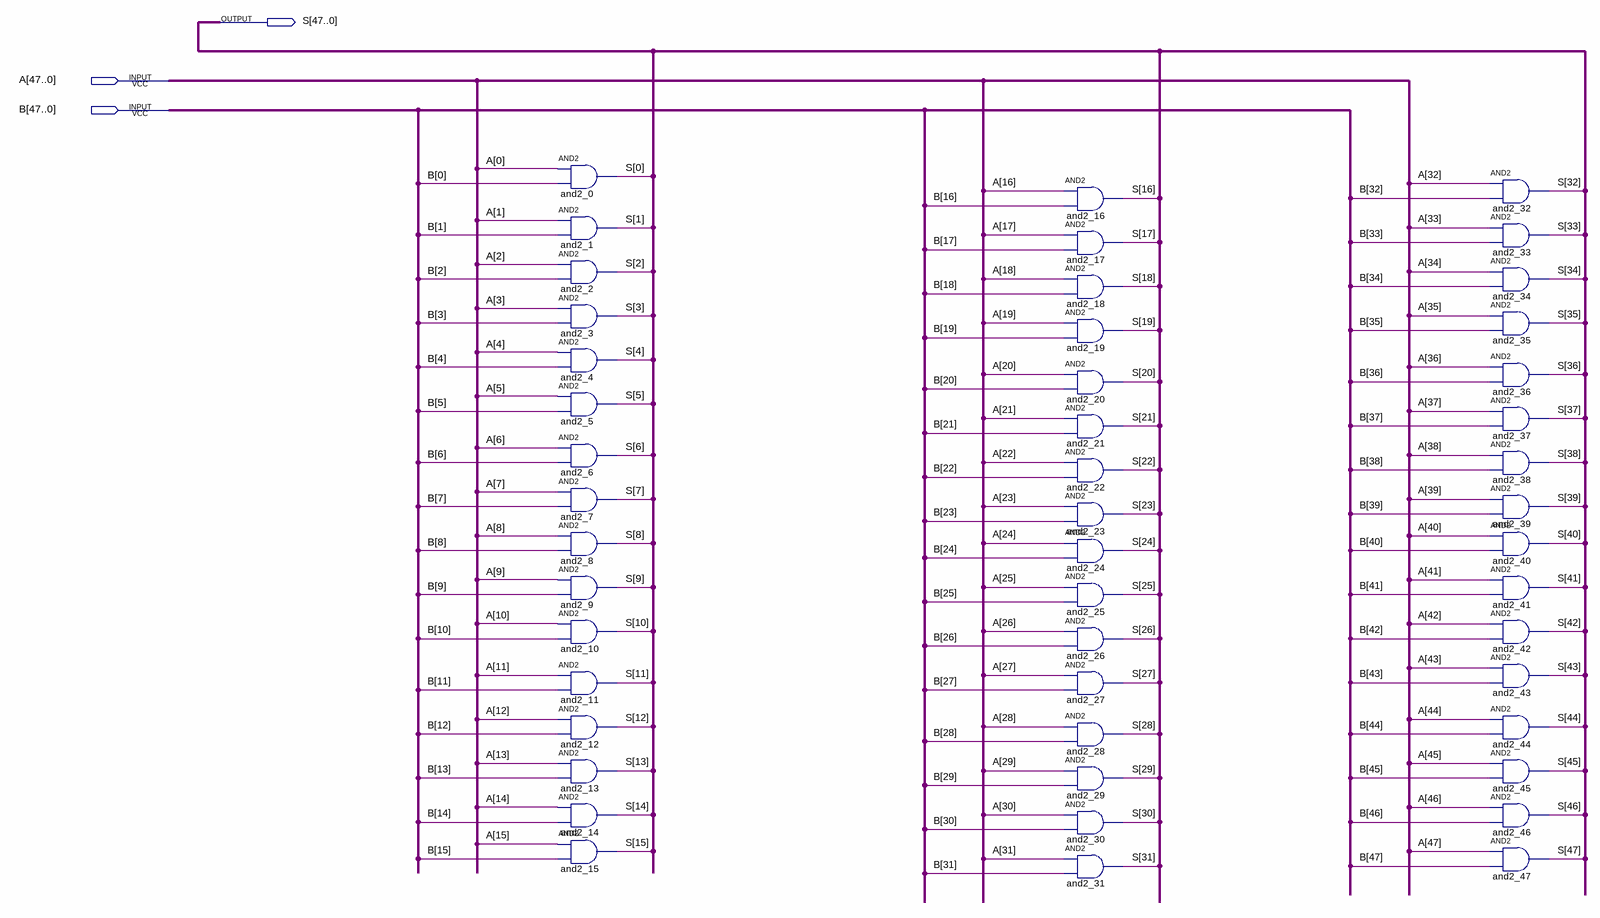
[diagram p0: schematic sheet]
// Quartus schematic AND_48bit.bdf as structural Verilog: 48 symbols, 3 pins
module AND_48bit (
  input  [47:0] A,
  input  [47:0] B,
  output [47:0] S
);

  and and2_0 (S[0], A[0], B[0]);
  and and2_1 (S[1], A[1], B[1]);
  and and2_2 (S[2], A[2], B[2]);
  and and2_3 (S[3], A[3], B[3]);
  and and2_4 (S[4], A[4], B[4]);
  and and2_5 (S[5], A[5], B[5]);
  and and2_6 (S[6], A[6], B[6]);
  and and2_7 (S[7], A[7], B[7]);
  and and2_8 (S[8], A[8], B[8]);
  and and2_9 (S[9], A[9], B[9]);
  and and2_10 (S[10], A[10], B[10]);
  and and2_11 (S[11], A[11], B[11]);
  and and2_12 (S[12], A[12], B[12]);
  and and2_13 (S[13], A[13], B[13]);
  and and2_14 (S[14], A[14], B[14]);
  and and2_15 (S[15], A[15], B[15]);
  and and2_16 (S[16], A[16], B[16]);
  and and2_17 (S[17], A[17], B[17]);
  and and2_18 (S[18], A[18], B[18]);
  and and2_19 (S[19], A[19], B[19]);
  and and2_20 (S[20], A[20], B[20]);
  and and2_21 (S[21], A[21], B[21]);
  and and2_22 (S[22], A[22], B[22]);
  and and2_23 (S[23], A[23], B[23]);
  and and2_24 (S[24], A[24], B[24]);
  and and2_25 (S[25], A[25], B[25]);
  and and2_26 (S[26], A[26], B[26]);
  and and2_27 (S[27], A[27], B[27]);
  and and2_28 (S[28], A[28], B[28]);
  and and2_29 (S[29], A[29], B[29]);
  and and2_30 (S[30], A[30], B[30]);
  and and2_31 (S[31], A[31], B[31]);
  and and2_32 (S[32], A[32], B[32]);
  and and2_33 (S[33], A[33], B[33]);
  and and2_34 (S[34], A[34], B[34]);
  and and2_35 (S[35], A[35], B[35]);
  and and2_36 (S[36], A[36], B[36]);
  and and2_37 (S[37], A[37], B[37]);
  and and2_38 (S[38], A[38], B[38]);
  and and2_39 (S[39], A[39], B[39]);
  and and2_40 (S[40], A[40], B[40]);
  and and2_41 (S[41], A[41], B[41]);
  and and2_42 (S[42], A[42], B[42]);
  and and2_43 (S[43], A[43], B[43]);
  and and2_44 (S[44], A[44], B[44]);
  and and2_45 (S[45], A[45], B[45]);
  and and2_46 (S[46], A[46], B[46]);
  and and2_47 (S[47], A[47], B[47]);
endmodule
